# EAGLE design PinOut_5 (EAGLE 7.2.0)
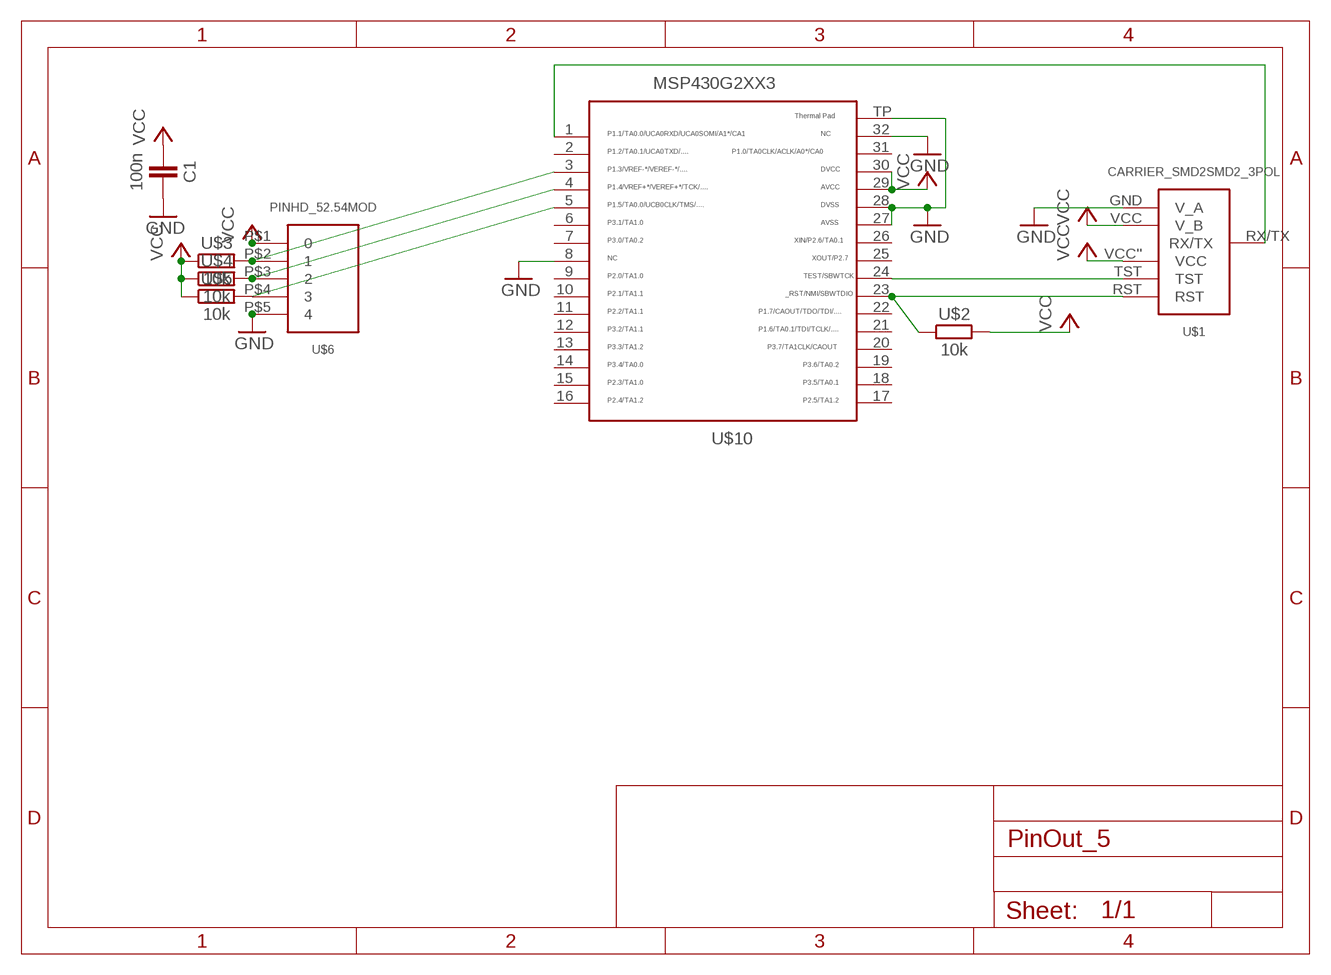
[diagram p0: schematic, sheet 1]

## Parts
C1  100n  CAPACITOR  [603]
U$1  CARRIER_SMD2SMD2_3POL  [CARRIER_SMD2_3POL]
U$2  10k  RESISTOR0603  [603]
U$3  10k  RESISTOR1206  [1206]
U$4  10k  RESISTOR1206  [1206]
U$5  10k  RESISTOR1206  [1206]
U$6  PINHD_52.54MOD  [PINHD_5_MOD]
U$10  MSP430G2553  [QFN32]

## Nets
GND: C1.2 U$1.GND(V_A) U$6.P$5 U$10.8 U$10.27 U$10.28 U$10.32 U$10.TP
N$2: U$3.2 U$6.P$2 U$10.3
N$3: U$1.TST U$10.24
N$4: U$1.RST U$2.1 U$10.23
N$5: U$4.2 U$6.P$3 U$10.4
N$6: U$5.2 U$6.P$4 U$10.5
N$12: U$1.RX/TX U$10.1
VCC: C1.1 U$1.VCC''(VCC) U$1.VCC(V_B) U$2.2 U$3.1 U$4.1 U$5.1 U$6.P$1 U$10.29 U$10.30
Unconnected: U$10.2 U$10.6 U$10.7 U$10.9 U$10.10 U$10.11 U$10.12 U$10.13 U$10.14 U$10.15 U$10.16 U$10.17 U$10.18 U$10.19 U$10.20 U$10.21 U$10.22 U$10.25 U$10.26 U$10.31

## Library data of the parts
C1 = thar:CAPACITOR
U$1 = thar:CARRIER_SMD2
U$2-U$5 = thar:RESISTOR
U$6 = thar:PINHD_5
U$10 = thar:MSP430G2553: TEXAS INSTRUMENTS MSP430G2553IRHB32R MCU, 16BIT, MSP430, 16MHZ, QFN-32 Farnell Best.Nr.: 2325726 Herst.Bez.: MSP430G2553IRHB32R

## Board
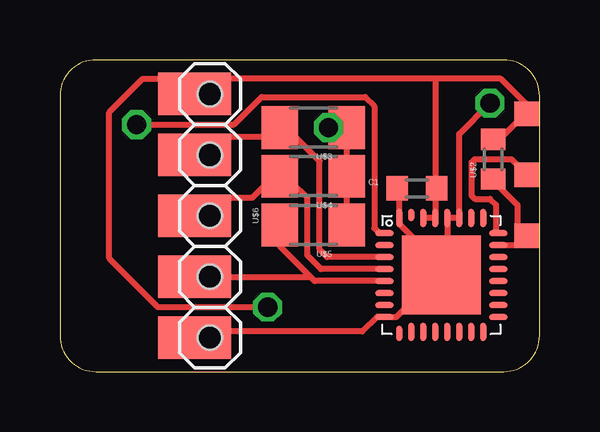
[diagram p1: board, top side]
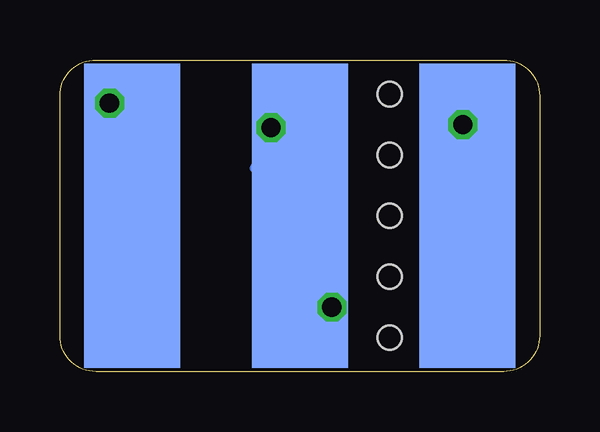
[diagram p2: board, bottom side, seen from below]

Size 20 x 13 mm. Coordinates in mm from the lower left corner, seen from the top.
Copper layers (1*16): Top 0.035mm / dielectric 1.5mm / Bottom 0.035mm
Design rules "Bilex DRU *": minimum track width 10mil, minimum drill 24mil, track to track 10mil, track to pad 10mil, pad to pad 10mil, via to via 10mil, smd to smd 10mil, copper to edge 1mil, drill to drill 8mil, minimum pad ring 10mil, minimum via ring 8mil, stop-mask expansion 4mil, vias tented up to drill 0mil, thermal gap 10mil

### Footprints (pad centres in the part's own frame; a part is rotated, then mirrored left to right if it is on the bottom)
603 = smd 0.889 x 1.016: 1 -0.826,0; 2 0.826,0
CARRIER_SMD2_3POL = smd 4 x 12.7 bottom: GND -6.985,0; RX/TX 6.985,0; VCC 0,0 | smd 1.016 x 1.016: RST -9.461,0.826; TST -9.461,-1.714; VCC'' -9.461,-4.255
1206 = smd 1.524 x 1.778: 1 -1.397,0; 2 1.397,0
PINHD_5_MOD = smd 1.778 x 3.048: P$1 -5.08,-0.635; P$2 -2.54,-0.635; P$3 0,-0.635; P$4 2.54,-0.635; P$5 5.08,-0.635 | hole 1.016: -5.08,0; -2.54,0; 0,0; 2.54,0; 5.08,0
QFN32 = smd 0.762 x 0.254: 1 -2.375,1.75; 2 -2.375,1.25; 3 -2.375,0.75; 4 -2.375,0.25; 5 -2.375,-0.25; 6 -2.375,-0.75; 7 -2.375,-1.25; 8 -2.375,-1.75; 17 2.375,-1.75; 18 2.375,-1.25; 19 2.375,-0.75; 20 2.375,-0.25; 21 2.375,0.25; 22 2.375,0.75; 23 2.375,1.25; 24 2.375,1.75 | smd 0.254 x 0.635: 9 -1.75,-2.438 | smd 0.254 x 0.762: 10 -1.25,-2.375; 11 -0.75,-2.375; 12 -0.25,-2.375; 13 0.25,-2.375; 14 0.75,-2.375; 15 1.25,-2.375; 16 1.75,-2.375; 25 1.75,2.375; 26 1.25,2.375; 27 0.75,2.375; 28 0.25,2.375; 29 -0.25,2.375; 30 -0.75,2.375; 32 -1.75,2.375 | smd 0.254 x 0.508: 31 -1.25,2.5 | smd 3.302 x 3.302: TP 0,0

### Placement (x,y rotation side)
C1  14.89,7.64 180 top
U$1  10,6.5 180 top
U$2  18.06,8.86 90 top
U$3  10.57,10.18 180 top
U$4  10.57,8.15 180 top
U$5  10.57,6.12 180 top
U$6  6.25,6.5 270 top
U$10  15.9,4.03 0 top

### Tracks (layer width: path | path; a pad name or v marks a point on that pad's centre or on a via)
GND  (via drill 0.8)
  Top 0.254: 16.43,4.35 16.19,5.38 16.16,5.35 | 16.43,4.35 16.48,3.06 U$10.TP 15.01,2.94 14.89,3.14 14.03,2.28 U$10.8 13.21,2.28 12.6,1.67 5.87,1.67 | 16.15,4.72 U$10.28 U$10.27 16.65,9.91 v17.93,11.2 | 16.15,4.72 16.15,4.42 16.43,4.35 | 16.15,4.72 15.52,5.35 14.76,5.55 14.15,6.16 U$10.32 14.15,7.36 14.12,7.59 14.12,7.83 C1.2 14.19,7.64 | 5.87,1.67 U$6.P$5 | 5.87,1.67 5.24,1.67
  Bottom 0.254: 18,6.5 18.06,6.56 v17.93,11.2 16.98,10.25 U$1.GND
N$2
  Top 0.254: U$10.3 11.14,4.78 10.82,5.1 10.82,8.78 9.43,10.18 U$3.2 9.17,9.8 6.25,9.8 U$6.P$2
N$3
  Top 0.254: 19.61,7.88 19.46,8.02 19.5,8.18 | U$10.24 18.19,5.78 18.19,6.95 17.93,7.21 17.3,7.21 17.17,7.33 17.17,8.73 17.3,8.86 18.82,8.86 19.5,8.18 | 19.5,8.18 U$1.TST
N$4
  Top 0.254: 19.46,5.48 19.5,5.38 19.46,5.42 U$1.RST | 19.46,5.48 19.5,5.69 19.08,5.74 19.08,6.95 18.06,7.97 U$2.1 | U$10.23 19.28,5.28 19.46,5.48
N$5
  Top 0.254: U$10.4 10.88,4.28 10.31,4.85 10.31,7.26 9.68,7.89 | 9.68,7.89 9.43,8.15 U$4.2 | U$6.P$3 6.38,7.26 8.03,7.26 8.66,7.89 9.68,7.89
N$6
  Top 0.254: U$10.5 10.62,3.78 10.57,3.83 10.44,3.96 | 10.44,3.96 9.17,5.23 U$5.2 | U$6.P$4 5.62,4.46 5.87,4.72 5.87,4.34 6.25,3.96 10.44,3.96
N$12  (via drill 0.8)
  Top 0.254: v3.2,10.31 7.27,10.31 8.41,11.45 12.73,11.45 13.11,11.07 13.11,5.99 13.32,5.78 U$10.1
  Bottom 0.254: U$1.RX/TX v3.2,10.31
VCC  (via drill 0.8)
  Top 0.254: U$10.29 | 15.65,12.21 15.65,8.02 | 15.65,8.02 U$10.29 | 15.78,7.77 15.71,8.02 | 15.71,8.02 15.65,8.02 | U$10.29 U$10.30 | C1.1 15.71,8.02 | 19.5,10.52 19.46,10.56 | U$2.2 18.12,9.48 19.2,10.56 19.2,10.51 19.46,10.56 | 19.65,10.81 19.65,10.95 18.39,12.21 15.65,12.21 | 19.65,10.81 19.65,10.75 19.46,10.56 | U$1.VCC'' 19.59,10.76 19.65,10.81 | 15.65,12.21 5.62,12.21 | U$3.1 U$4.1 U$5.1 U$3.1 | 5.62,12.21 U$6.P$1 | U$3.1 v11.2,10.18 | v8.66,2.69 4.09,2.69 2.06,4.72 2.06,10.81 3.46,12.21 5.62,12.21
  Bottom 0.254: 10,1.35 U$1.VCC 11.97,8.47 v11.2,10.18 | 9.93,1.04 10,1.1 10,1.35 | 10,1.35 v8.66,2.69